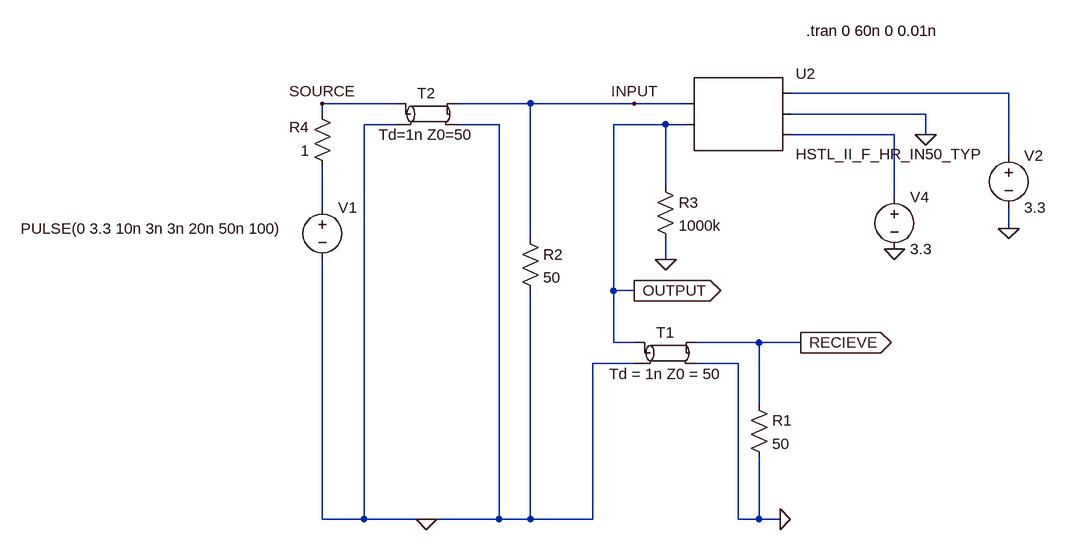
[diagram p0: schematic SIMULATION_OUTPUT_HSTL_IN50.asc]
* SIMULATION_OUTPUT_HSTL_IN50.asc
V1 N003 0 PULSE(0 3.3 10n 3n 3n 20n 50n 100)
V2 N001 0 3.3
T1 OUTPUT 0 RECIEVE 0 Td = 1n Z0 = 50
R3 OUTPUT 0 1000k
T2 SOURCE 0 INPUT 0 Td=1n Z0=50
R4 N003 SOURCE 1
* U2: HSTL_II_F_HR_IN50_TYP (symbol AutoGenerated\HSTL_II_F_HR_IN50_TYP not available, pins judged from their places): pin1=INPUT pin2=OUTPUT pin3=N001 pin4=0 pin5=N002
V4 N002 0 3.3
R1 RECIEVE 0 50
R2 INPUT 0 50
.tran 0 60n 0 0.01n
.backanno
.end

* Results of the author's LTspice run, read from the files saved beside the schematic
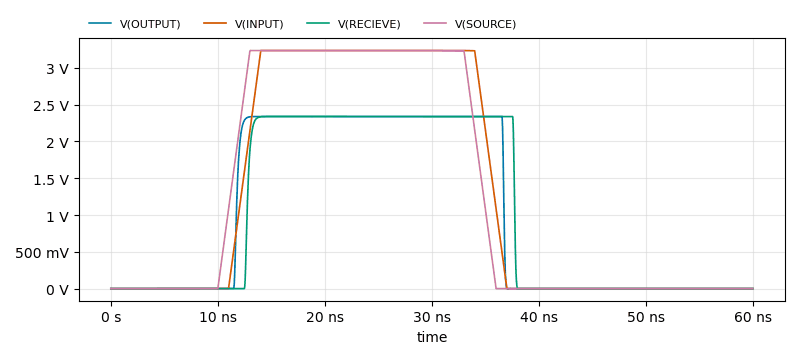
[diagram p1: Transient Analysis of SIMULATION_OUTPUT_HSTL_IN50.asc, plotted from the saved traces]
* Transient Analysis, 1 run:
*   V(OUTPUT): min -2.571 mV, max 2.339 V, average 970.9 mV, rms 1.501 V, last 0 V
*   V(INPUT): min 0 V, max 3.235 V, average 1.24 V, rms 1.963 V, last 0 V
*   V(RECIEVE): min -2.571 mV, max 2.339 V, average 970.9 mV, rms 1.501 V, last 0 V
*   V(SOURCE): min 0 V, max 3.238 V, average 1.24 V, rms 1.964 V, last 0 V